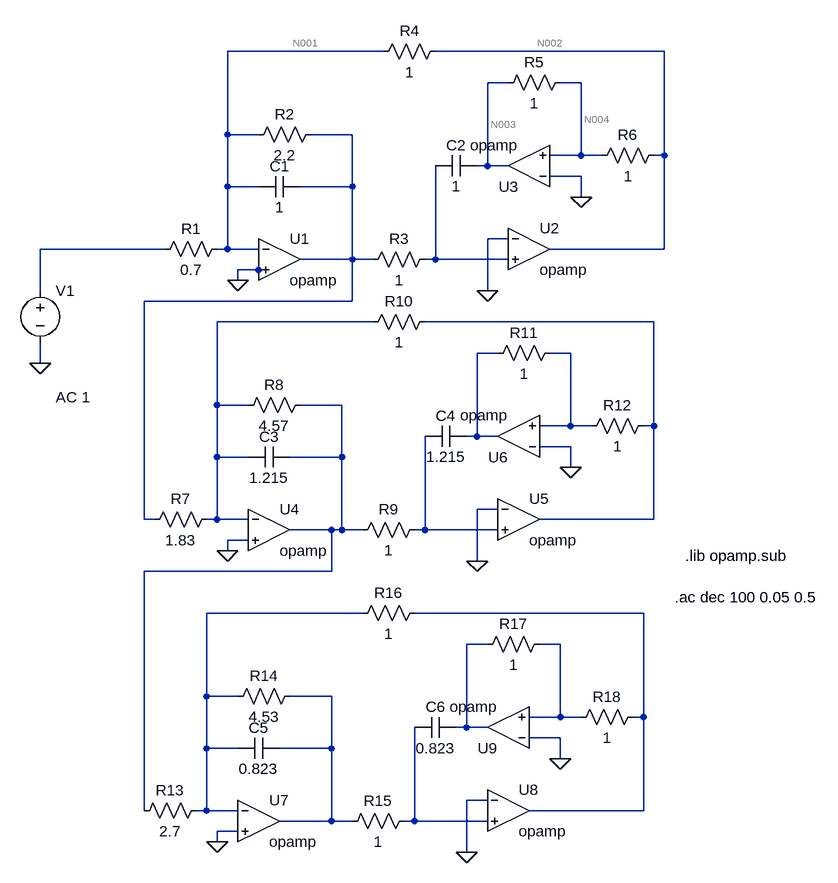
[diagram p0: schematic ack.asc]
ack.asc, the LTspice schematic file:
Version 4
SHEET 1 1268 1064
WIRE 400 -208 160 -208
WIRE 832 -208 480 -208
WIRE 592 -160 560 -160
WIRE 704 -160 672 -160
WIRE 160 -80 160 -208
WIRE 208 -80 160 -80
WIRE 352 -80 288 -80
WIRE 704 -48 704 -160
WIRE 704 -48 656 -48
WIRE 736 -48 704 -48
WIRE 832 -48 832 -208
WIRE 832 -48 816 -48
WIRE 560 -32 560 -160
WIRE 560 -32 544 -32
WIRE 592 -32 560 -32
WIRE 704 -16 656 -16
WIRE 160 0 160 -80
WIRE 208 0 160 0
WIRE 352 0 352 -80
WIRE 352 0 272 0
WIRE 704 16 704 -16
WIRE 592 80 560 80
WIRE 64 96 -128 96
WIRE 160 96 160 0
WIRE 160 96 144 96
WIRE 208 96 160 96
WIRE 832 96 832 -48
WIRE 832 96 656 96
WIRE 352 112 352 0
WIRE 352 112 272 112
WIRE 384 112 352 112
WIRE 480 112 480 -32
WIRE 480 112 464 112
WIRE 592 112 480 112
WIRE 208 128 176 128
WIRE 224 128 208 128
WIRE 176 144 176 128
WIRE -128 160 -128 96
WIRE 560 160 560 80
WIRE 352 176 352 112
WIRE 352 176 32 176
WIRE 384 208 144 208
WIRE 816 208 464 208
WIRE 576 256 544 256
WIRE 688 256 656 256
WIRE -128 272 -128 240
WIRE 144 336 144 208
WIRE 192 336 144 336
WIRE 336 336 272 336
WIRE 688 368 688 256
WIRE 688 368 640 368
WIRE 720 368 688 368
WIRE 816 368 816 208
WIRE 816 368 800 368
WIRE 544 384 544 256
WIRE 544 384 528 384
WIRE 576 384 544 384
WIRE 688 400 640 400
WIRE 144 416 144 336
WIRE 192 416 144 416
WIRE 336 416 336 336
WIRE 336 416 256 416
WIRE 688 432 688 400
WIRE 576 496 544 496
WIRE 32 512 32 176
WIRE 48 512 32 512
WIRE 144 512 144 416
WIRE 144 512 128 512
WIRE 192 512 144 512
WIRE 816 512 816 368
WIRE 816 512 640 512
WIRE 320 528 256 528
WIRE 336 528 336 416
WIRE 336 528 320 528
WIRE 368 528 336 528
WIRE 464 528 464 384
WIRE 464 528 448 528
WIRE 576 528 464 528
WIRE 192 544 160 544
WIRE 160 560 160 544
WIRE 544 576 544 496
WIRE 320 592 320 528
WIRE 320 592 32 592
WIRE 368 656 128 656
WIRE 800 656 448 656
WIRE 560 704 528 704
WIRE 672 704 640 704
WIRE 128 784 128 656
WIRE 176 784 128 784
WIRE 320 784 256 784
WIRE 672 816 672 704
WIRE 672 816 624 816
WIRE 704 816 672 816
WIRE 800 816 800 656
WIRE 800 816 784 816
WIRE 528 832 528 704
WIRE 528 832 512 832
WIRE 560 832 528 832
WIRE 672 848 624 848
WIRE 128 864 128 784
WIRE 176 864 128 864
WIRE 320 864 320 784
WIRE 320 864 240 864
WIRE 672 880 672 848
WIRE 560 944 528 944
WIRE 32 960 32 592
WIRE 128 960 128 864
WIRE 128 960 112 960
WIRE 176 960 128 960
WIRE 800 960 800 816
WIRE 800 960 624 960
WIRE 320 976 320 864
WIRE 320 976 240 976
WIRE 352 976 320 976
WIRE 448 976 448 832
WIRE 448 976 432 976
WIRE 560 976 448 976
WIRE 176 992 144 992
WIRE 144 1008 144 992
WIRE 528 1024 528 944
FLAG 704 16 0
FLAG 560 160 0
FLAG 688 432 0
FLAG 544 576 0
FLAG 672 880 0
FLAG 528 1024 0
FLAG 176 144 0
FLAG 160 560 0
FLAG 144 1008 0
FLAG -128 272 0
SYMBOL res 160 80 R90
WINDOW 0 0 56 VBottom 2
WINDOW 3 32 56 VTop 2
SYMATTR InstName R1
SYMATTR Value 0.7
SYMBOL res 304 -96 R90
WINDOW 0 0 56 VBottom 2
WINDOW 3 32 56 VTop 2
SYMATTR InstName R2
SYMATTR Value 2.2
SYMBOL res 480 96 R90
WINDOW 0 0 56 VBottom 2
WINDOW 3 32 56 VTop 2
SYMATTR InstName R3
SYMATTR Value 1
SYMBOL res 496 -224 R90
WINDOW 0 0 56 VBottom 2
WINDOW 3 32 56 VTop 2
SYMATTR InstName R4
SYMATTR Value 1
SYMBOL res 688 -176 R90
WINDOW 0 0 56 VBottom 2
WINDOW 3 32 56 VTop 2
SYMATTR InstName R5
SYMATTR Value 1
SYMBOL res 832 -64 R90
WINDOW 0 0 56 VBottom 2
WINDOW 3 32 56 VTop 2
SYMATTR InstName R6
SYMATTR Value 1
SYMBOL cap 272 -16 R90
WINDOW 0 0 32 VBottom 2
WINDOW 3 32 32 VTop 2
SYMATTR InstName C1
SYMATTR Value 1
SYMBOL cap 544 -48 R90
WINDOW 0 0 32 VBottom 2
WINDOW 3 32 32 VTop 2
SYMATTR InstName C2
SYMATTR Value 1
SYMBOL Opamps\\opamp 240 48 R0
SYMATTR InstName U1
SYMBOL Opamps\\opamp 624 32 R0
SYMATTR InstName U2
SYMBOL Opamps\\opamp 624 32 R180
SYMATTR InstName U3
SYMBOL voltage -128 144 R0
WINDOW 3 24 152 Left 2
WINDOW 123 24 180 Left 2
WINDOW 39 0 0 Left 2
SYMATTR InstName V1
SYMATTR Value ""
SYMATTR Value2 AC 1
SYMBOL res 144 496 R90
WINDOW 0 0 56 VBottom 2
WINDOW 3 32 56 VTop 2
SYMATTR InstName R7
SYMATTR Value 1.83
SYMBOL res 288 320 R90
WINDOW 0 0 56 VBottom 2
WINDOW 3 32 56 VTop 2
SYMATTR InstName R8
SYMATTR Value 4.57
SYMBOL res 464 512 R90
WINDOW 0 0 56 VBottom 2
WINDOW 3 32 56 VTop 2
SYMATTR InstName R9
SYMATTR Value 1
SYMBOL res 480 192 R90
WINDOW 0 0 56 VBottom 2
WINDOW 3 32 56 VTop 2
SYMATTR InstName R10
SYMATTR Value 1
SYMBOL res 672 240 R90
WINDOW 0 0 56 VBottom 2
WINDOW 3 32 56 VTop 2
SYMATTR InstName R11
SYMATTR Value 1
SYMBOL res 816 352 R90
WINDOW 0 0 56 VBottom 2
WINDOW 3 32 56 VTop 2
SYMATTR InstName R12
SYMATTR Value 1
SYMBOL cap 256 400 R90
WINDOW 0 0 32 VBottom 2
WINDOW 3 32 32 VTop 2
SYMATTR InstName C3
SYMATTR Value 1.215
SYMBOL cap 528 368 R90
WINDOW 0 0 32 VBottom 2
WINDOW 3 32 32 VTop 2
SYMATTR InstName C4
SYMATTR Value 1.215
SYMBOL Opamps\\opamp 224 464 R0
SYMATTR InstName U4
SYMBOL Opamps\\opamp 608 448 R0
SYMATTR InstName U5
SYMBOL Opamps\\opamp 608 448 R180
SYMATTR InstName U6
SYMBOL res 128 944 R90
WINDOW 0 0 56 VBottom 2
WINDOW 3 32 56 VTop 2
SYMATTR InstName R13
SYMATTR Value 2.7
SYMBOL res 272 768 R90
WINDOW 0 0 56 VBottom 2
WINDOW 3 32 56 VTop 2
SYMATTR InstName R14
SYMATTR Value 4.53
SYMBOL res 448 960 R90
WINDOW 0 0 56 VBottom 2
WINDOW 3 32 56 VTop 2
SYMATTR InstName R15
SYMATTR Value 1
SYMBOL res 464 640 R90
WINDOW 0 0 56 VBottom 2
WINDOW 3 32 56 VTop 2
SYMATTR InstName R16
SYMATTR Value 1
SYMBOL res 656 688 R90
WINDOW 0 0 56 VBottom 2
WINDOW 3 32 56 VTop 2
SYMATTR InstName R17
SYMATTR Value 1
SYMBOL res 800 800 R90
WINDOW 0 0 56 VBottom 2
WINDOW 3 32 56 VTop 2
SYMATTR InstName R18
SYMATTR Value 1
SYMBOL cap 240 848 R90
WINDOW 0 0 32 VBottom 2
WINDOW 3 32 32 VTop 2
SYMATTR InstName C5
SYMATTR Value 0.823
SYMBOL cap 512 816 R90
WINDOW 0 0 32 VBottom 2
WINDOW 3 32 32 VTop 2
SYMATTR InstName C6
SYMATTR Value 0.823
SYMBOL Opamps\\opamp 208 912 R0
SYMATTR InstName U7
SYMBOL Opamps\\opamp 592 896 R0
SYMATTR InstName U8
SYMBOL Opamps\\opamp 592 896 R180
SYMATTR InstName U9
TEXT 864 568 Left 2 !.lib opamp.sub
TEXT 848 632 Left 2 !.ac dec 100 0.05 0.5

The netlist it stands for:
* ack.asc
R1 N001 N006 0.7
R2 N005 N001 2.2
R3 N007 N005 1
R4 N002 N001 1
R5 N004 N003 1
R6 N002 N004 1
C1 N005 N001 1
C2 N003 N007 1
XU1 N001 0 N005 opamp Aol=100K GBW=10Meg  ; pins invin noninvin out
XU2 0 N007 N002 opamp Aol=100K GBW=10Meg  ; pins invin noninvin out
XU3 0 N004 N003 opamp Aol=100K GBW=10Meg  ; pins invin noninvin out
V1 N006 0 AC 1
R7 N008 N005 1.83
R8 N012 N008 4.57
R9 N013 N012 1
R10 N009 N008 1
R11 N011 N010 1
R12 N009 N011 1
C3 N012 N008 1.215
C4 N010 N013 1.215
XU4 N008 0 N012 opamp Aol=100K GBW=10Meg  ; pins invin noninvin out
XU5 0 N013 N009 opamp Aol=100K GBW=10Meg  ; pins invin noninvin out
XU6 0 N011 N010 opamp Aol=100K GBW=10Meg  ; pins invin noninvin out
R13 N014 N012 2.7
R14 N018 N014 4.53
R15 N019 N018 1
R16 N015 N014 1
R17 N017 N016 1
R18 N015 N017 1
C5 N018 N014 0.823
C6 N016 N019 0.823
XU7 N014 0 N018 opamp Aol=100K GBW=10Meg  ; pins invin noninvin out
XU8 0 N019 N015 opamp Aol=100K GBW=10Meg  ; pins invin noninvin out
XU9 0 N017 N016 opamp Aol=100K GBW=10Meg  ; pins invin noninvin out
.lib opamp.sub
.ac dec 100 0.05 0.5
.backanno
.end

* Results of the author's LTspice run, read from the files saved beside the schematic
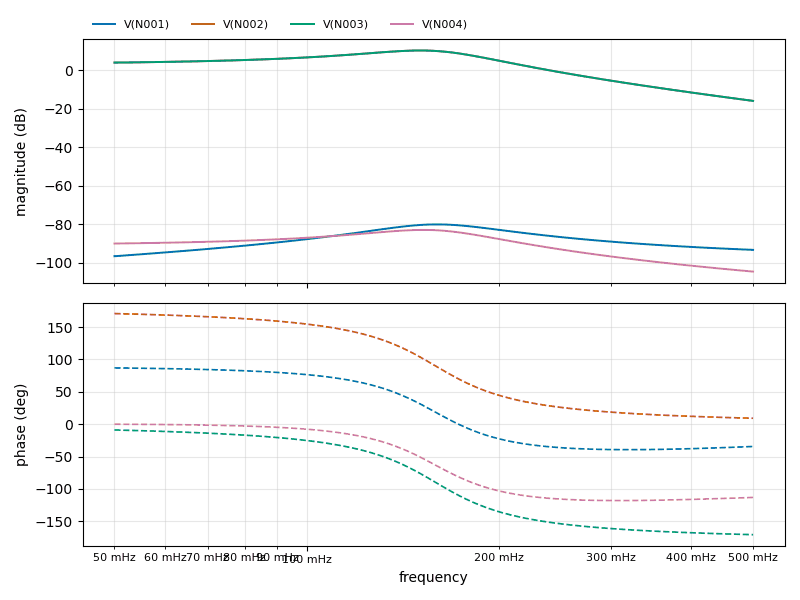
[diagram p1: AC Analysis of ack.asc, plotted from the saved traces]
* AC Analysis, 1 run:
*   V(N001): -96.57 dB at 50 mHz, -93.26 dB at 500 mHz, peak -80.06 dB at 161.8 mHz, 3 dB below the peak at 128 mHz and 202.1 mHz
*   V(N002): 3.89 dB at 50 mHz, -15.97 dB at 500 mHz, peak 10.17 dB at 151 mHz, 3 dB below the peak at 107.2 mHz and 184.2 mHz
*   V(N003): 3.89 dB at 50 mHz, -15.97 dB at 500 mHz, peak 10.18 dB at 151 mHz, 3 dB below the peak at 107.2 mHz and 184.2 mHz
*   V(N004): -89.98 dB at 50 mHz, -104.54 dB at 500 mHz, peak -82.92 dB at 151 mHz, 3 dB below the peak at 111.7 mHz and 187 mHz